# Altium project BalanceCar.PrjPcb
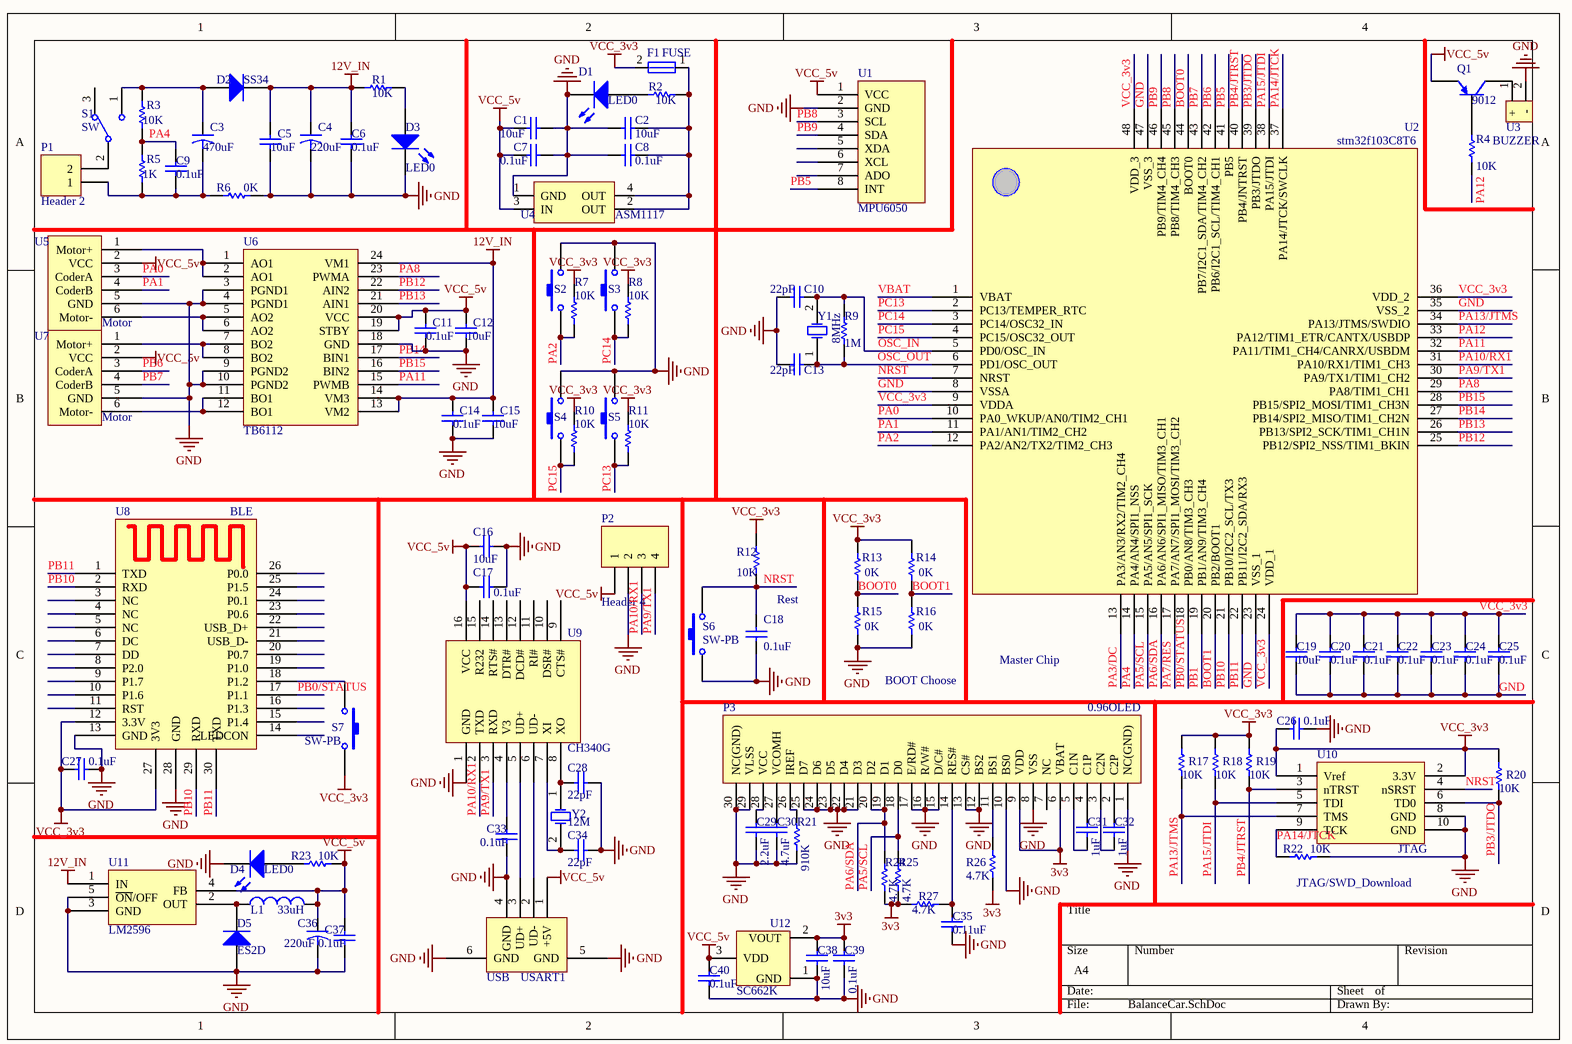
[diagram p0: BalanceCar.SchDoc]
1 sheet, 100 parts. Net scope: global (net labels, ports and power ports of the same name join across sheets).
Board file: BalanceCar.PcbDoc

## Sheet BalanceCar.SchDoc
size A4

### Parts
C1  value 10uF  [0805]
C2  value 10uF  [0805]
C3  value 470uF  [SMD_8*10.5]
C4  value 220uF  [SMD_8*10.5]
C5  value 10uF  [0805]
C6  value 0.1uF  [0603]
C7  value 0.1uF  [0603]
C8  value 0.1uF  [0603]
C9  value 0.1uF  [0603]
C10  value 22pF  [0603]
C11  value 0.1uF  [0603]
C12  value 10uF  [0805]
C13  value 22pF  [0603]
C14  value 0.1uF  [0603]
C15  value 10uF  [0805]
C16  value 10uF  [0805]
C17  value 0.1uF  [0603]
C18  value 0.1uF  [0603]
C19  value 10uF  [0805]
C20  value 0.1uF  [0603]
C21  value 0.1uF  [0603]
C22  value 0.1uF  [0603]
C23  value 0.1uF  [0603]
C24  value 0.1uF  [0603]
C25  value 0.1uF  [0603]
C26  value 0.1uF  [0603]
C27  value 0.1uF  [0603]
C28  value 22pF  [0603]
C29  value 2.2uF  [0603]
C30  value 4.7uF  [0603]
C31  value 1uF  [0603]
C32  value 1uF  [0603]
C33  value 0.1uF  [0603]
C34  value 22pF  [0603]
C35  value 0.11uF  [0603]
C36  value 220uF  [SMD_8*10.5]
C37  value 0.1uF  [0603]
C38  value 10uF  [0805]
C39  value 0.1uF  [0603]
C40  value 0.1uF  [0603]
D1  LED0  [LED]
D2  SS34  [SMA]
D3  LED0  [LED]
D4  LED0  [LED]
D5  ES2D  [SMA]
F1  FUSE  [1206]
L1  value 33uH  [CD54]
P1  Header 2  [T]
P2  Header 4  [HEADER 4PIN 2.54mm]
P3  0.96OLED  [OLED]
Q1  9012  [SOP23]
R1  value 10K  [RES]
R2  value 10K  [RES]
R3  value 10K  [RES]
R4  value 10K  [RES]
R5  value 1K  [RES]
R6  value 0K  [RES]
R7  value 10K  [RES]
R8  value 10K  [RES]
R9  value 1M  [RES]
R10  value 10K  [RES]
R11  value 10K  [RES]
R12  value 10K  [RES]
R13  value 0K  [RES]
R14  value 0K  [RES]
R15  value 0K  [RES]
R16  value 0K  [RES]
R17  value 10K  [RES]
R18  value 10K  [RES]
R19  value 10K  [RES]
R20  value 10K  [RES]
R21  value 910K  [RES]
R22  value 10K  [RES]
R23  value 10K  [RES]
R24  value 4.7K  [RES]
R25  value 4.7K  [RES]
R26  value 4.7K  [RES]
R27  value 4.7K  [RES]
S1  SW  [MTS102]
S2  (no value)  [KEY_SOT_P2]
S3  (no value)  [KEY_SOT_P2]
S4  (no value)  [KEY_SOT_P2]
S5  (no value)  [KEY_SOT_P2]
S6  SW-PB  [KEY_SOT_P2]
S7  SW-PB  [KEY_SOT_P2]
U1  MPU6050  [MPU6050]
U2  stm32f103C8T6  [LQFP48]
U3  BUZZER  [BUZZER]
U4  ASM1117  [SOT-223]
U5  Motor  [Motor]
U6  TB6112  [SSOP24]
U7  Motor  [Motor]
U8  BLE  [BLUETOOTH]
U9  CH340G  [SOP-16]
U10  JTAG  [HEADER 2x5 2mm]
U11  LM2596  [TO263-5]
U12  SC662K  [SOP23]
USART1  USB  [Micro_USB]
Y1  8MHz  [HC-49S]
Y2  12M  [HC-49S]

### Nets
3v3: C38.2 C39.2 P3.6(VBAT) P3.9(VDD) R24.2 R25.2 R26.2 R27.1 U12.2(VOUT)
12V_IN: C4.1 C5.2 C6.2 C14.2 C15.2 D2.2(K) R1.1 U6.13(VM2) U6.14(VM3) U6.24(VM1) U11.1(IN)
GND: C1.2 C2.1 C4.2 C5.1 C6.1 C7.2 C8.1 C10.1 C11.1 C12.1 C13.1 C14.1 C15.1 C16.1 C17.1 C18.1 C19.1 C20.1 C21.1 C22.1 C23.1 C24.1 C25.1 C26.2 C27.2 C28.1 C29.1 C30.1 C33.1 C34.1 C35.1 C36.2 C37.1 C38.1 C39.1 C40.1 D1.2(K) D3.2(K) D4.2(K) D5.1(A) P2.2 P3.1(NC(GND)) P3.8(VSS) P3.10(BS0) P3.12(BS2) P3.13(CS#) P3.15(D/C#) P3.16(R/W#) P3.17(E/RD#) P3.21(D3) P3.22(D4) P3.23(D5) P3.24(D6) P3.25(D7) P3.29(VLSS) P3.30(NC(GND)) R6.2 R15.1 R16.1 R21.2 R22.1 S2.2 S3.2 S4.2 S5.2 S6.1 U1.2(GND) U2.8(VSSA) U2.23(VSS_1) U2.35(VSS_2) U2.47(VSS_3) U3.2(-) U4.1(GND) U5.5(GND) U6.3(PGND1) U6.4(PGND1) U6.9(PGND2) U6.10(PGND2) U6.18(GND) U7.5(GND) U8.13(GND) U8.28(GND) U9.1(GND) U10.8(GND) U10.10(GND) U11.3(GND) U11.5(~{ON}/OFF) U12.1(GND) USART1.4(GND) USART1.5(GND) USART1.6(GND)
VCC_3v3: C19.2 C20.2 C21.2 C22.2 C23.2 C24.2 C25.2 C26.1 C27.1 F1.2 R7.2 R8.2 R10.2 R11.2 R12.2 R13.2 R14.2 R17.2 R18.2 R19.2 R20.2 S7.2 U2.9(VDDA) U2.24(VDD_1) U2.36(VDD_2) U2.48(VDD_3) U8.12(3.3V) U8.27(3V3) U10.1(Vref) U10.2(3.3V)
VCC_5v: C1.1 C7.1 C11.2 C12.2 C16.2 C17.2 C36.1 C37.2 C40.2 L1.2 P2.1 Q1.2(E) R23.1 U1.1(VCC) U4.3(IN) U5.2(VCC) U6.19(STBY) U6.20(VCC) U7.2(VCC) U9.16(VCC) U11.4(FB) U12.3(VDD) USART1.1(+5V)
BOOT0: R13.1 R15.2 U2.44(BOOT0)
BOOT1: R14.1 R16.2 U2.20(PB2/BOOT1)
NRST: C18.2 R12.1 S6.2 U2.7(NRST) U10.4(nSRST)
OSC_IN: C10.2 R9.2 U2.5(PD0/OSC_IN) Y1.2(OSC2)
OSC_OUT: C13.2 R9.1 U2.6(PD1/OSC_OUT) Y1.1(OSC1)
PA0: U2.10(PA0_WKUP/AN0/TIM2_CH1) U5.3(CoderA)
PA1: U2.11(PA1/AN1/TIM2_CH2) U5.4(CoderB)
PA2: R7.1 S2.1 U2.12(PA2/AN2/TX2/TIM2_CH3)
PA3/DC: U2.13(PA3/AN3/RX2/TIM2_CH4)
PA4: C9.2 R3.1 R5.2 U2.14(PA4/AN4/SPI1_NSS)
PA5/SCL: P3.18(D0) R25.1 U2.15(PA5/AN5/SPI1_SCK)
PA6/SDA: P3.19(D1) P3.20(D2) R24.1 U2.16(PA6/AN6/SPI1_MISO/TIM3_CH1)
PA7/RES: U2.17(PA7/AN7/SPI1_MOSI/TIM3_CH2)
PA8: U2.29(PA8/TIM1_CH1) U6.23(PWMA)
PA9/TX1: P2.4 U2.30(PA9/TX1/TIM1_CH2) U9.3(RXD)
PA10/RX1: P2.3 U2.31(PA10/RX1/TIM1_CH3) U9.2(TXD)
PA11: U2.32(PA11/TIM1_CH4/CANRX/USBDM) U6.15(PWMB)
PA12: R4.1 U2.33(PA12/TIM1_ETR/CANTX/USBDP)
PA13/JTMS: R17.1 U2.34(PA13/JTMS/SWDIO) U10.7(TMS)
PA14/JTCK: R22.2 U2.37(PA14/JTCK/SWCLK) U10.9(TCK)
PA15/JTDI: R18.1 U2.38(PA15/JTDI) U10.5(TDI)
PB0/STATUS: U2.18(PB0/AN8/TIM3_CH3) U8.17(P1.1)
PB1: U2.19(PB1/AN9/TIM3_CH4)
PB3/JTDO: R20.1 U2.39(PB3/JTDO) U10.6(TD0)
PB4/JTRST: R19.1 U2.40(PB4/JNTRST) U10.3(nTRST)
PB5: U1.8(INT) U2.41(PB5)
PB6: U2.42(PB6/I2C1_SCL/TIM4_CH1) U7.3(CoderA)
PB7: U2.43(PB7/I2C1_SDA/TIM4_CH2) U7.4(CoderB)
PB8: U1.3(SCL) U2.45(PB8/TIM4_CH3)
PB9: U1.4(SDA) U2.46(PB9/TIM4_CH4)
PB10: U2.21(PB10/I2C2_SCL/TX3) U8.2(RXD) U8.29(RXD)
PB11: U2.22(PB11/I2C2_SDA/RX3) U8.1(TXD) U8.30(TXD)
PB12: U2.25(PB12/SPI2_NSS/TIM1_BKIN) U6.22(AIN2)
PB13: U2.26(PB13/SPI2_SCK/TIM1_CH1N) U6.21(AIN1)
PB14: U2.27(PB14/SPI2_MISO/TIM1_CH2N) U6.17(BIN1)
PB15: U2.28(PB15/SPI2_MOSI/TIM1_CH3N) U6.16(BIN2)
PC13: R11.1 S5.1 U2.2(PC13/TEMPER_RTC)
PC14: R8.1 S3.1 U2.3(PC14/OSC32_IN)
PC15: R10.1 S4.1 U2.4(PC15/OSC32_OUT)
VBAT: U2.1(VBAT)
NetC2_2: C2.2 C8.2 F1.1 R2.2 U4.2(OUT) U4.4(OUT)
NetC3_1: C3.1 D2.1(A) R3.2 S1.1
NetC3_2: C3.2 C9.1 P1.1 R5.1 R6.1
NetC28_2: C28.2 U9.8(XO) Y2.1(OSC1)
NetC29_2: C29.2 P3.28(VCC)
NetC30_2: C30.2 P3.27(VCOMH)
NetC31_1: C31.1 P3.5(C1N)
NetC31_2: C31.2 P3.4(C1P)
NetC32_1: C32.1 P3.3(C2N)
NetC32_2: C32.2 P3.2(C2P)
NetC33_2: C33.2 U9.4(V3)
NetC34_2: C34.2 U9.7(XI) Y2.2(OSC2)
NetC35_2: C35.2 P3.14(RES#) R27.2
NetD1_1: D1.1(A) R2.1
NetD3_1: D3.1(A) R1.2
NetD4_1: D4.1(A) R23.2
NetD5_2: D5.2(K) L1.1 U11.2(OUT)
NetP1_2: P1.2 S1.2
NetP3_11: P3.11(BS1) R26.1
NetP3_26: P3.26(IREF) R21.1
NetQ1_1: Q1.1(B) R4.2
NetQ1_3: Q1.3(C) U3.1(+)
NetS7_1: S7.1 U8.18(P1.2)
NetU5_1: U5.1(Motor+) U6.1(AO1) U6.2(AO1)
NetU5_6: U5.6(Motor-) U6.5(AO2) U6.6(AO2)
NetU6_7: U6.7(BO2) U6.8(BO2) U7.1(Motor+)
NetU6_11: U6.11(BO1) U6.12(BO1) U7.6(Motor-)
NetU9_5: U9.5(UD+) USART1.3(UD+)
NetU9_6: U9.6(UD-) USART1.2(UD-)

Not connected (* = marked no-connect by the designer): P3 7(NC); S1 3; U1 5(XDA) 6(XCL) 7(ADO); U8 3(NC) 4(NC) 5(NC) 6(DC) 7(DD) 8(P2.0) 9(P1.7) 10(P1.6) 11(RST) 14(LEDCON) 15(P1.4) 16(P1.3) 19(P1.0) 20(P0.7) 21(USB_D-) 22(USB_D+) 23(P0.6) 24(P0.1) 25(P1.5) 26(P0.0); U9 9(CTS#) 10(DSR#) 11(RI#) 12(DCD#) 13(DTR#) 14(RTS#) 15(R232)

### Notes on the sheet
- Rest
- Master Chip
- BOOT Choose
- (near R22) JTAG/SWD_Download

### Library data of the parts
C1 C2 C5-C35 C37-C40 = Cap: Capacitor; Published: 8-Jun-2000; LatestRevisionDate: 17-Jul-2002; LatestRevisionNote: Re-released for DXP Platform.; PackageReference: RAD-0.3; Publisher: Altium Limited; PackageDescription: Radial Cap, Thru-Hole; 2 Leads; 0.3 in Pin Spacing
C3 C4 C36 = Cap2: Capacitor; Published: 23-Sep-2002; PackageReference: CAPR5-4X5; Publisher: Altium Limited; PackageDescription: Capacitor; 2 Leads
D1 D3 D4 = LED0: Typical INFRARED GaAs LED; Published: 8-Jun-2000; LatestRevisionDate: 08-Jul-2005; LatestRevisionNote: Mech Layer 1 removed.; PackageReference: LED-0; Publisher: Altium Limited; PackageDescription: LED; 2 Leads
D2 = Diode 1N4001: 1 Amp General Purpose Rectifier; Published: 8-Jun-2000; LatestRevisionDate: 17-Jul-2002; LatestRevisionNote: Re-released for DXP Platform.; DatasheetVersion: 1998; PackageVersion: Aug-1999; PackageReference: DO-41; Publisher: Altium Limited; PackageDescription: Diode, Axial; Body 5.2 x 2.7 mm (LxDia. max), Lead Dia. 0.86 mm (max); Code_JEDEC: DO-204-AL; ComponentLink1Description: Manufacturer Link; ComponentLink1URL: http://www.fairchildsemi.com/; ComponentLink2Description: Datasheet; ComponentLink2URL: http://www.fairchildsemi.com/ds/1N%2F1N4001.pdf
D5 = Diode 1N914: High Conductance Fast Diode; Published: 8-Jun-2000; LatestRevisionDate: 17-Jul-2002; LatestRevisionNote: Re-released for DXP Platform.; DatasheetVersion: 1997; PackageReference: DO-35; Publisher: Altium Limited; PackageDescription: Diode, Axial; Body 3.8 x 1.9 mm (LxDia. max), Lead Dia. 0.53 mm (max); Code_JEDEC: DO-204-AH; ComponentLink1Description: Manufacturer Link; ComponentLink1URL: http://www.fairchildsemi.com/; ComponentLink2Description: Datasheet; ComponentLink2URL: http://www.fairchildsemi.com/ds/1N%2F1N4448.pdf
L1 = Inductor: Code_IEC: 1005; Published: 8-Jun-2000; LatestRevisionDate: 29-May-2009; LatestRevisionNote: IPC-7351 Footprint Added.; PackageReference: 0402-A; Publisher: Altium Limited; PackageDescription: Chip Inductor; Code_JEITA: 0402
P1 = Header 2: Header, 2-Pin; LatestRevisionDate: 17-Jul-2002; LatestRevisionNote: Re-released for DXP Platform.; Publisher: Altium Limited
P2 = Header 4: Header, 4-Pin; LatestRevisionDate: 17-Jul-2002; LatestRevisionNote: Re-released for DXP Platform.; Publisher: Altium Limited
P3 = 0.96OLED: 接口; LatestRevisionDate: 17-Jul-2002; LatestRevisionNote: Re-released for DXP Platform.; Publisher: Altium Limited
Q1 = PNP: PNP Bipolar Transistor; Published: 8-Jun-2000; LatestRevisionDate: 17-Jul-2002; LatestRevisionNote: Re-released for DXP Platform.; PackageReference: SOT-23B; Publisher: Altium Limited; Code_JEDEC: SOT-23
R1-R27 = Res1: Resistor; Published: 8-Jun-2000; LatestRevisionDate: 17-Jul-2002; LatestRevisionNote: Re-released for DXP Platform.; PackageReference: AXIAL-0.3; Publisher: Altium Limited; PackageDescription: Axial Device, Thru-Hole; 2 Leads; 0.3 in Pin Spacing
S1 = SW-SPDT: SPDT Subminiature Toggle Switch, Right Angle Mounting, Vertical Actuation; Published: 24-Mar-1999; LatestRevisionDate: 17-Dec-2003; LatestRevisionNote: Schematic revised, PCB Footprint replaced.; DatasheetVersion: 05-Dec-2000; PackageReference: TL36WW15050; Publisher: Altium Limited; PackageDescription: Switch; 4 Leads; ComponentLink1Description: Manufacturer Link; ComponentLink1URL: http://www.apem.com
S2-S7 = SW-PB: Switch; Published: 24-Mar-1999; LatestRevisionDate: 17-Jul-2002; LatestRevisionNote: Re-released for DXP Platform.; PackageReference: SPST-2; Publisher: Altium Limited; PackageDescription: Switch; 2 Leads
Y1 Y2 = XTAL: Crystal Oscillator; Published: 8-Jun-2000; LatestRevisionDate: 17-Jul-2002; LatestRevisionNote: Re-released for DXP Platform.; PackageReference: R38; Publisher: Altium Limited; PackageDescription: Crystal, Thru-Hole; 2 Leads; Body 3.1 x 8.2 mm (Dia.xH)